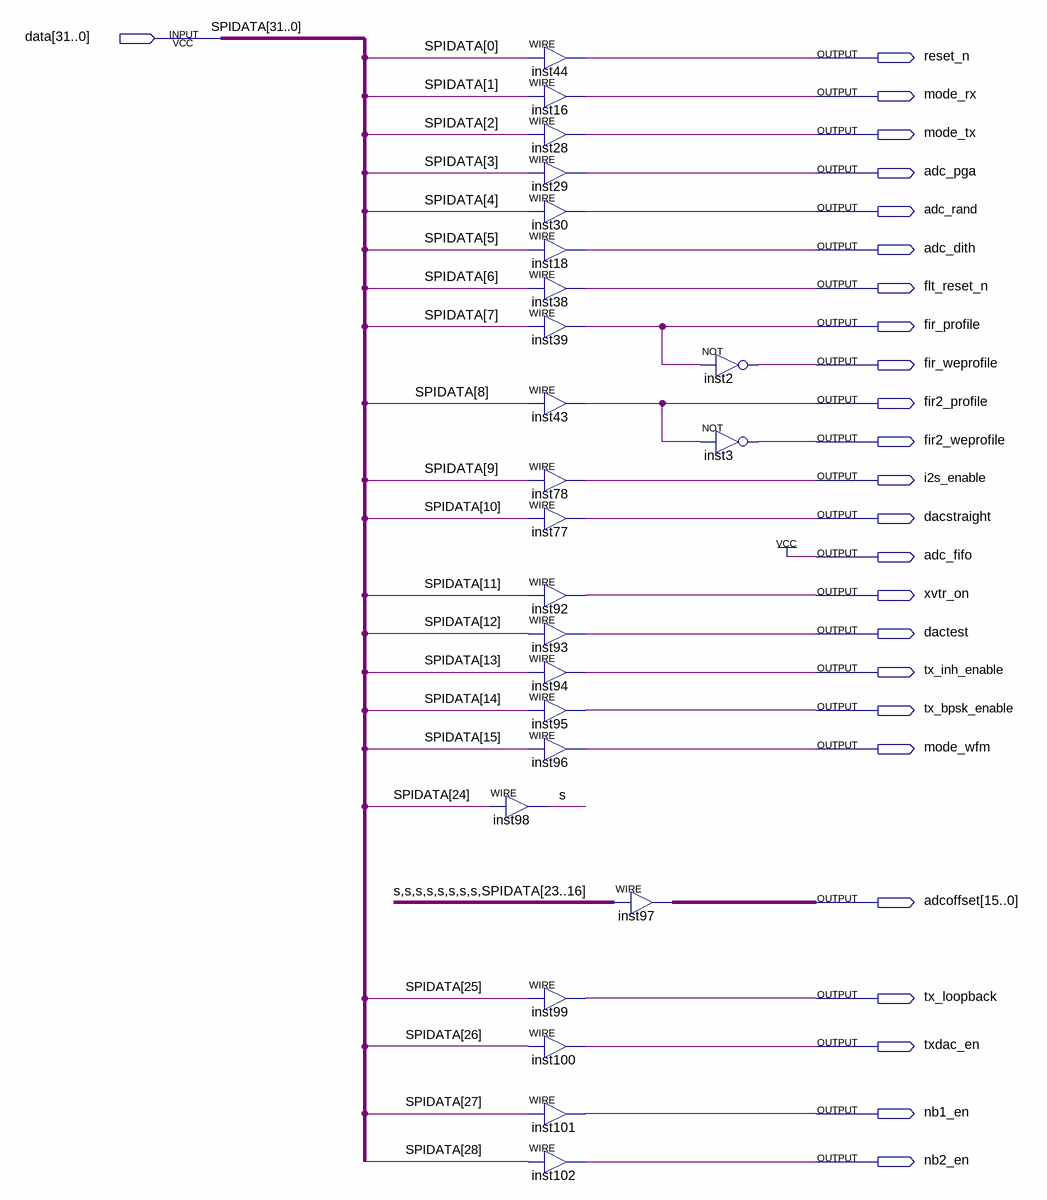
[diagram p0: schematic sheet]
// Quartus schematic ctlbridge.bdf as structural Verilog: 24 symbols, 25 pins
module ctlbridge (
  input  [31:0] data,
  output reset_n,
  output mode_rx,
  output mode_tx,
  output adc_pga,
  output adc_rand,
  output adc_dith,
  output flt_reset_n,
  output fir_profile,
  output fir_weprofile,
  output fir2_profile,
  output fir2_weprofile,
  output i2s_enable,
  output dacstraight,
  output adc_fifo,
  output xvtr_on,
  output dactest,
  output tx_inh_enable,
  output tx_bpsk_enable,
  output mode_wfm,
  output [15:0] adcoffset,
  output tx_loopback,
  output txdac_en,
  output nb1_en,
  output nb2_en
);

  wire s;

  assign reset_n = data[0];  // WIRE inst44
  assign mode_rx = data[1];  // WIRE inst16
  assign mode_tx = data[2];  // WIRE inst28
  assign adc_pga = data[3];  // WIRE inst29
  assign adc_rand = data[4];  // WIRE inst30
  assign adc_dith = data[5];  // WIRE inst18
  assign flt_reset_n = data[6];  // WIRE inst38
  assign fir_profile = data[7];  // WIRE inst39
  assign fir2_profile = data[8];  // WIRE inst43
  assign i2s_enable = data[9];  // WIRE inst78
  assign dacstraight = data[10];  // WIRE inst77
  assign xvtr_on = data[11];  // WIRE inst92
  assign dactest = data[12];  // WIRE inst93
  assign tx_inh_enable = data[13];  // WIRE inst94
  assign tx_bpsk_enable = data[14];  // WIRE inst95
  assign mode_wfm = data[15];  // WIRE inst96
  assign s = data[24];  // WIRE inst98
  assign tx_loopback = data[25];  // WIRE inst99
  assign txdac_en = data[26];  // WIRE inst100
  assign nb1_en = data[27];  // WIRE inst101
  assign nb2_en = data[28];  // WIRE inst102
  assign adcoffset = {{8{s}}, data[23:16]};  // WIRE inst97
  not inst2 (fir_weprofile, fir_profile);
  not inst3 (fir2_weprofile, fir2_profile);

  assign adc_fifo = 1'b1;

  // Other names for the same wires on the sheet: SPIDATA[31:0] = data
endmodule
